# Altium schematic sheet ECU_AutoRC_MOT_BEMF_r00.SchDoc
size A4; SheetNumber: 8; SheetTotal: 9
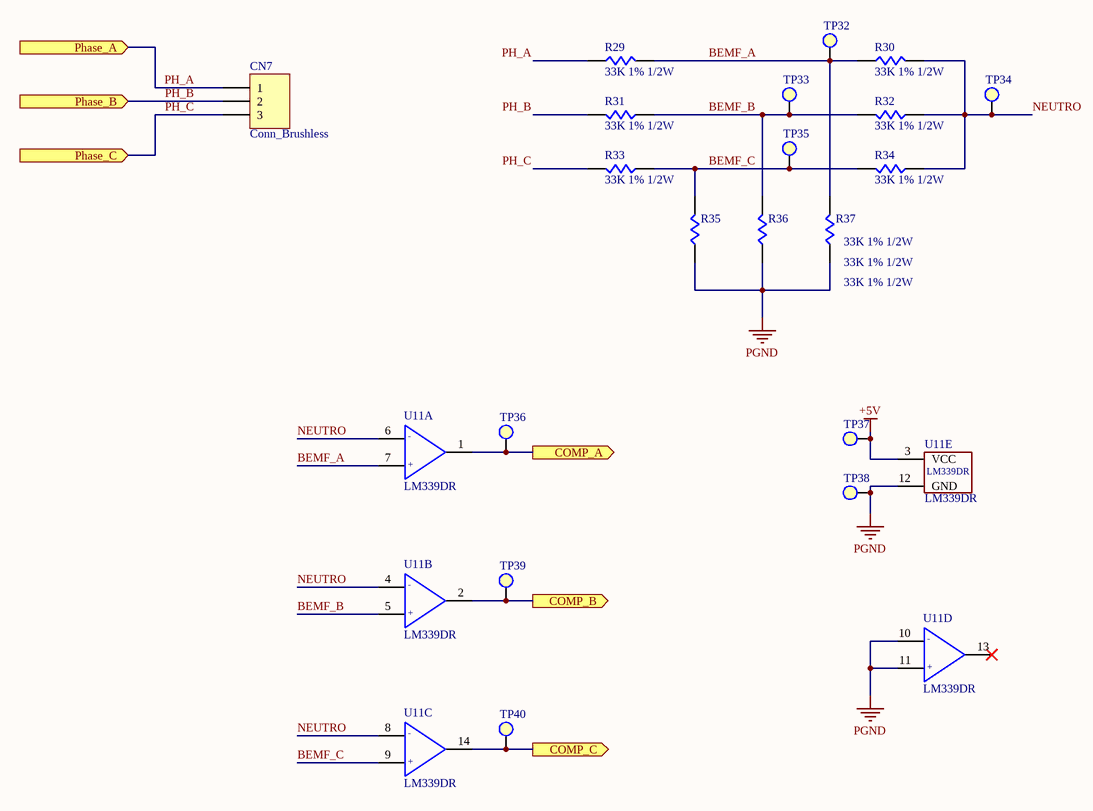
[diagram p0: ECU_AutoRC_MOT_BEMF_r00.SchDoc]

## Parts
CN7  Conn_Brushless  [CONN_BRUSHLESS]
R29  33K 1% 1/2W  [R_0805]
R30  33K 1% 1/2W  [R_0805]
R31  33K 1% 1/2W  [R_0805]
R32  33K 1% 1/2W  [R_0805]
R33  33K 1% 1/2W  [R_0805]
R34  33K 1% 1/2W  [R_0805]
R35  33K 1% 1/2W  [R_0805]
R36  33K 1% 1/2W  [R_0805]
R37  33K 1% 1/2W  [R_0805]
TP32  Test Point  [TEST_POINT]  (value not drawn)
TP33  Test Point  [TEST_POINT]  (value not drawn)
TP34  Test Point  [TEST_POINT]  (value not drawn)
TP35  Test Point  [TEST_POINT]  (value not drawn)
TP36  Test Point  [TEST_POINT]  (value not drawn)
TP37  Test Point  [TEST_POINT]  (value not drawn)
TP38  Test Point  [TEST_POINT]  (value not drawn)
TP39  Test Point  [TEST_POINT]  (value not drawn)
TP40  Test Point  [TEST_POINT]  (value not drawn)
U11  LM339DR  [SOIC14]  (parts A,B,C,D,E of 5)

## Ports
COMP_A (out, see ECU_AutoRC_BLK_r00[4C], ECU_AutoRC_UC1_r00[1C]), COMP_B (out, see ECU_AutoRC_BLK_r00[4C], ECU_AutoRC_UC1_r00[1C]), COMP_C (out, see ECU_AutoRC_BLK_r00[4C], ECU_AutoRC_UC1_r00[1C]), Phase_A (in, see ECU_AutoRC_BLK_r00[4C], ECU_AutoRC_MOT_DRIVER_r00[4B]), Phase_B (in, see ECU_AutoRC_BLK_r00[4C], ECU_AutoRC_MOT_DRIVER_r00[4C]), Phase_C (in, see ECU_AutoRC_BLK_r00[4C], ECU_AutoRC_MOT_DRIVER_r00[2C])

## Nets
+5V: TP37.1 U11.3(VCC)
PGND: R35.1 R36.1 R37.1 TP38.1 U11.10(IN4-) U11.11(IN4+) U11.12(GND)
BEMF_A: R29.2 R30.1 R37.2 TP32.1 U11.7(IN1+)
BEMF_B: R31.1 R32.2 R36.2 TP33.1 U11.5(IN2+)
BEMF_C: R33.1 R34.2 R35.2 TP35.1 U11.9(IN3+)
COMP_A: TP36.1 U11.1(OUT1) ; port COMP_A
COMP_B: TP39.1 U11.2(OUT2) ; port COMP_B
COMP_C: TP40.1 U11.14(OUT3) ; port COMP_C
NEUTRO: R30.2 R32.1 R34.1 TP34.1 U11.4(IN2-) U11.6(IN1-) U11.8(IN3-)
PH_A: CN7.1 R29.1 ; port Phase_A
PH_B: CN7.2 R31.2 ; port Phase_B
PH_C: CN7.3 R33.2 ; port Phase_C

Not connected (* = marked no-connect by the designer): U11 13(OUT4)*

## Notes on the sheet
- (in symbol LM339DR, part A) -; +
- (in symbol LM339DR, part B) -; +
- (in symbol LM339DR, part C) -; +
- (in symbol LM339DR, part D) -; +

## Library data of the parts
CN7 = CONN_03P: 3 Pin Connector
R29-R37 = Resistor
TP32-TP40 = TestPoint
U11 = LM339DR: Comparator Standard Open-Collector 14-SOIC